# EAGLE schematic Arch GPRS (EAGLE 6.4)
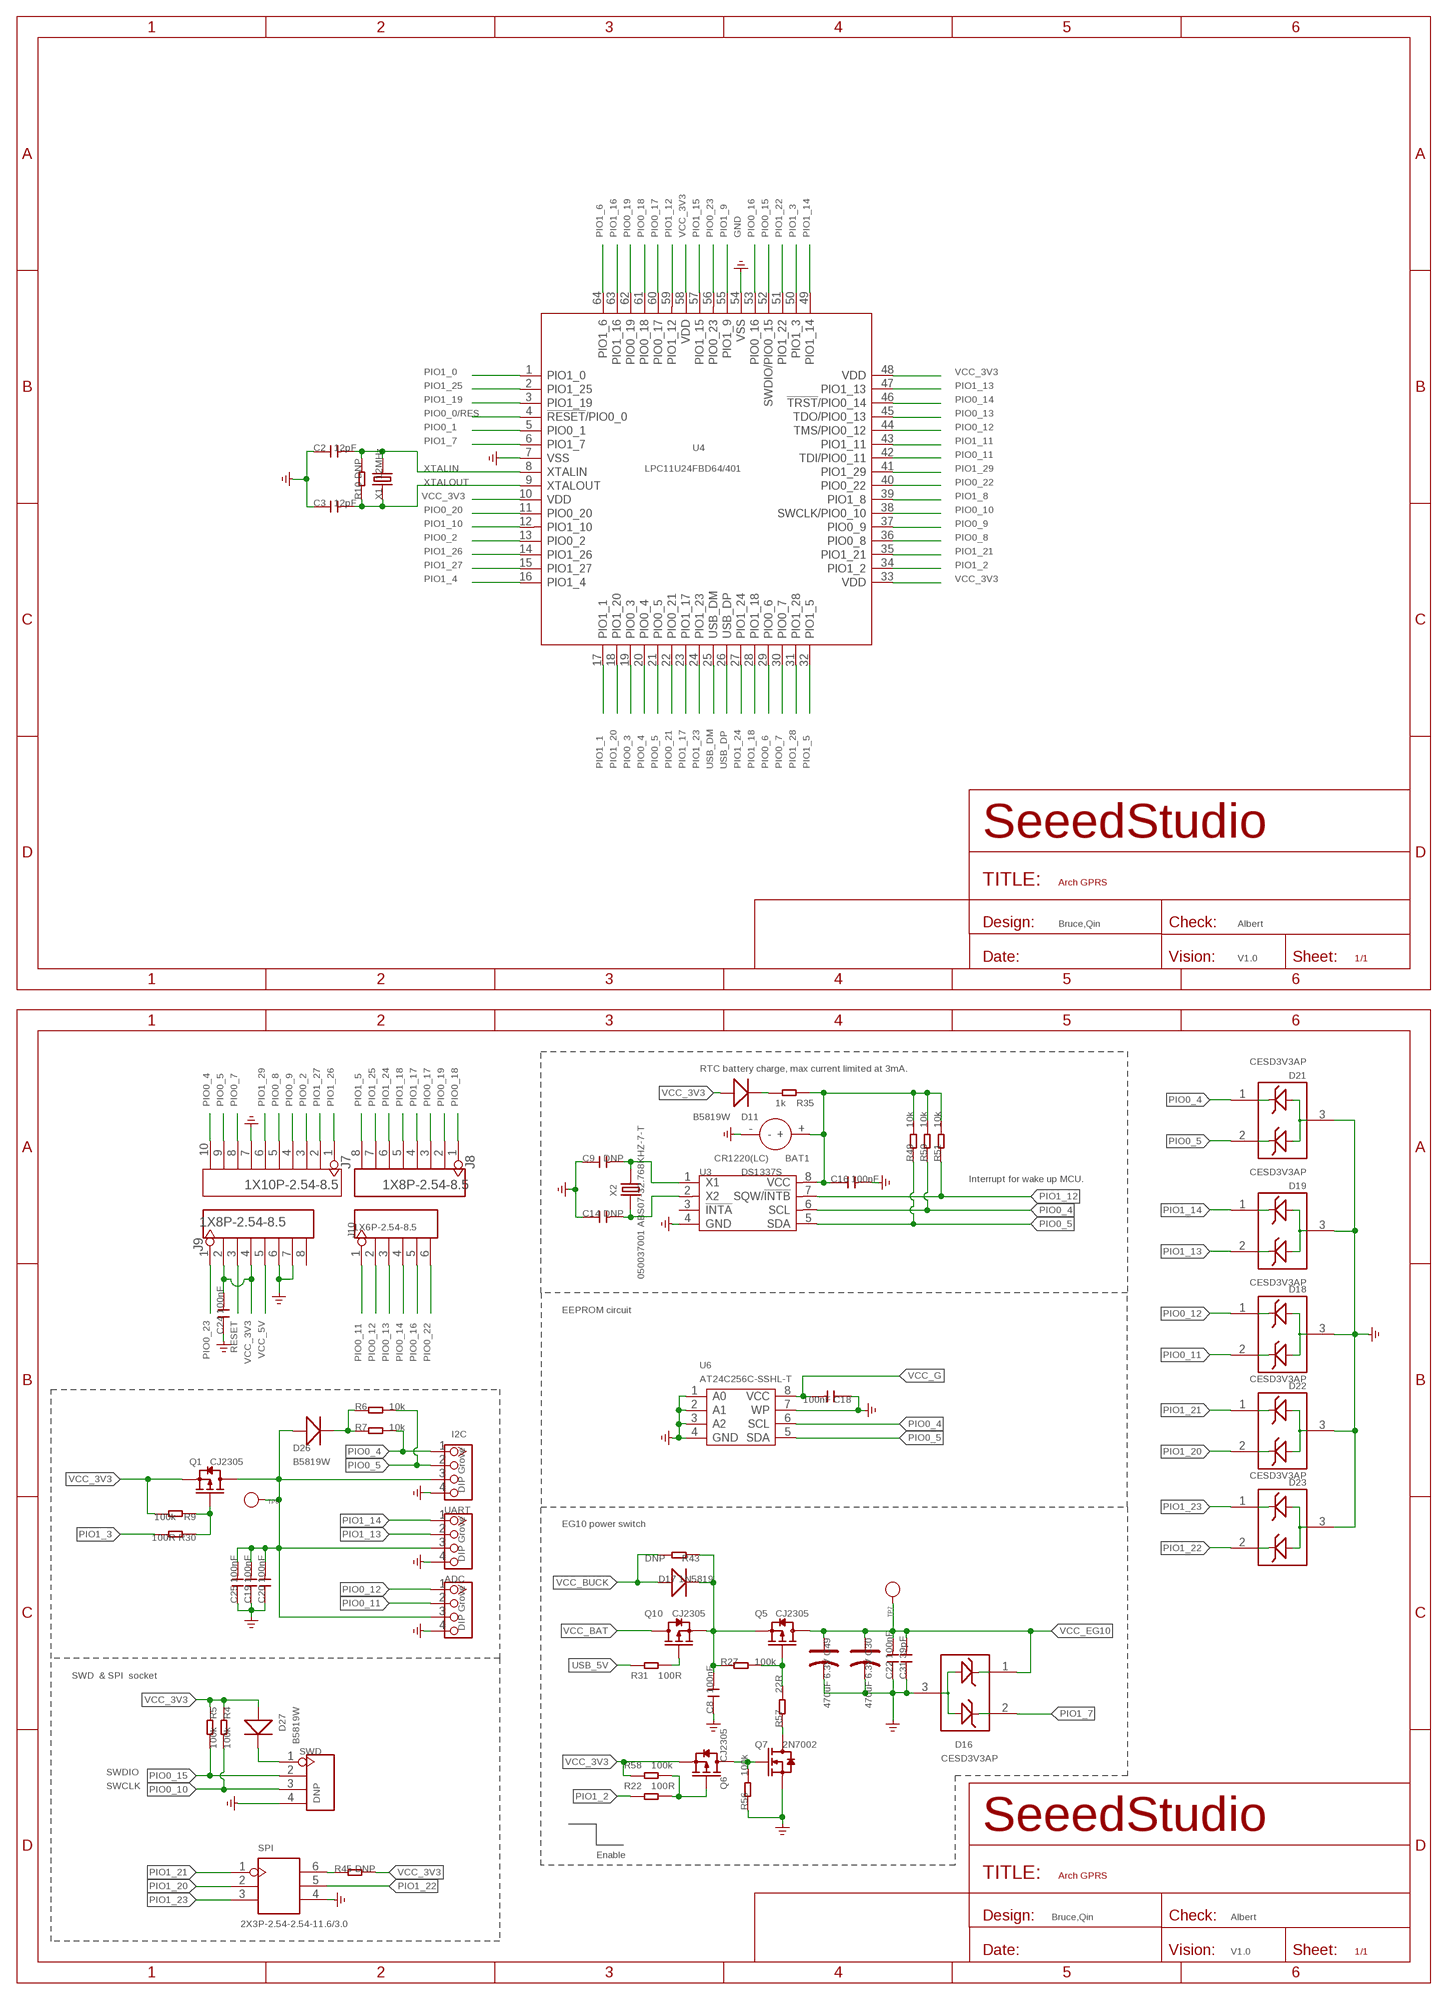
[diagram p0: schematic, sheet 1, part 1 of 2]
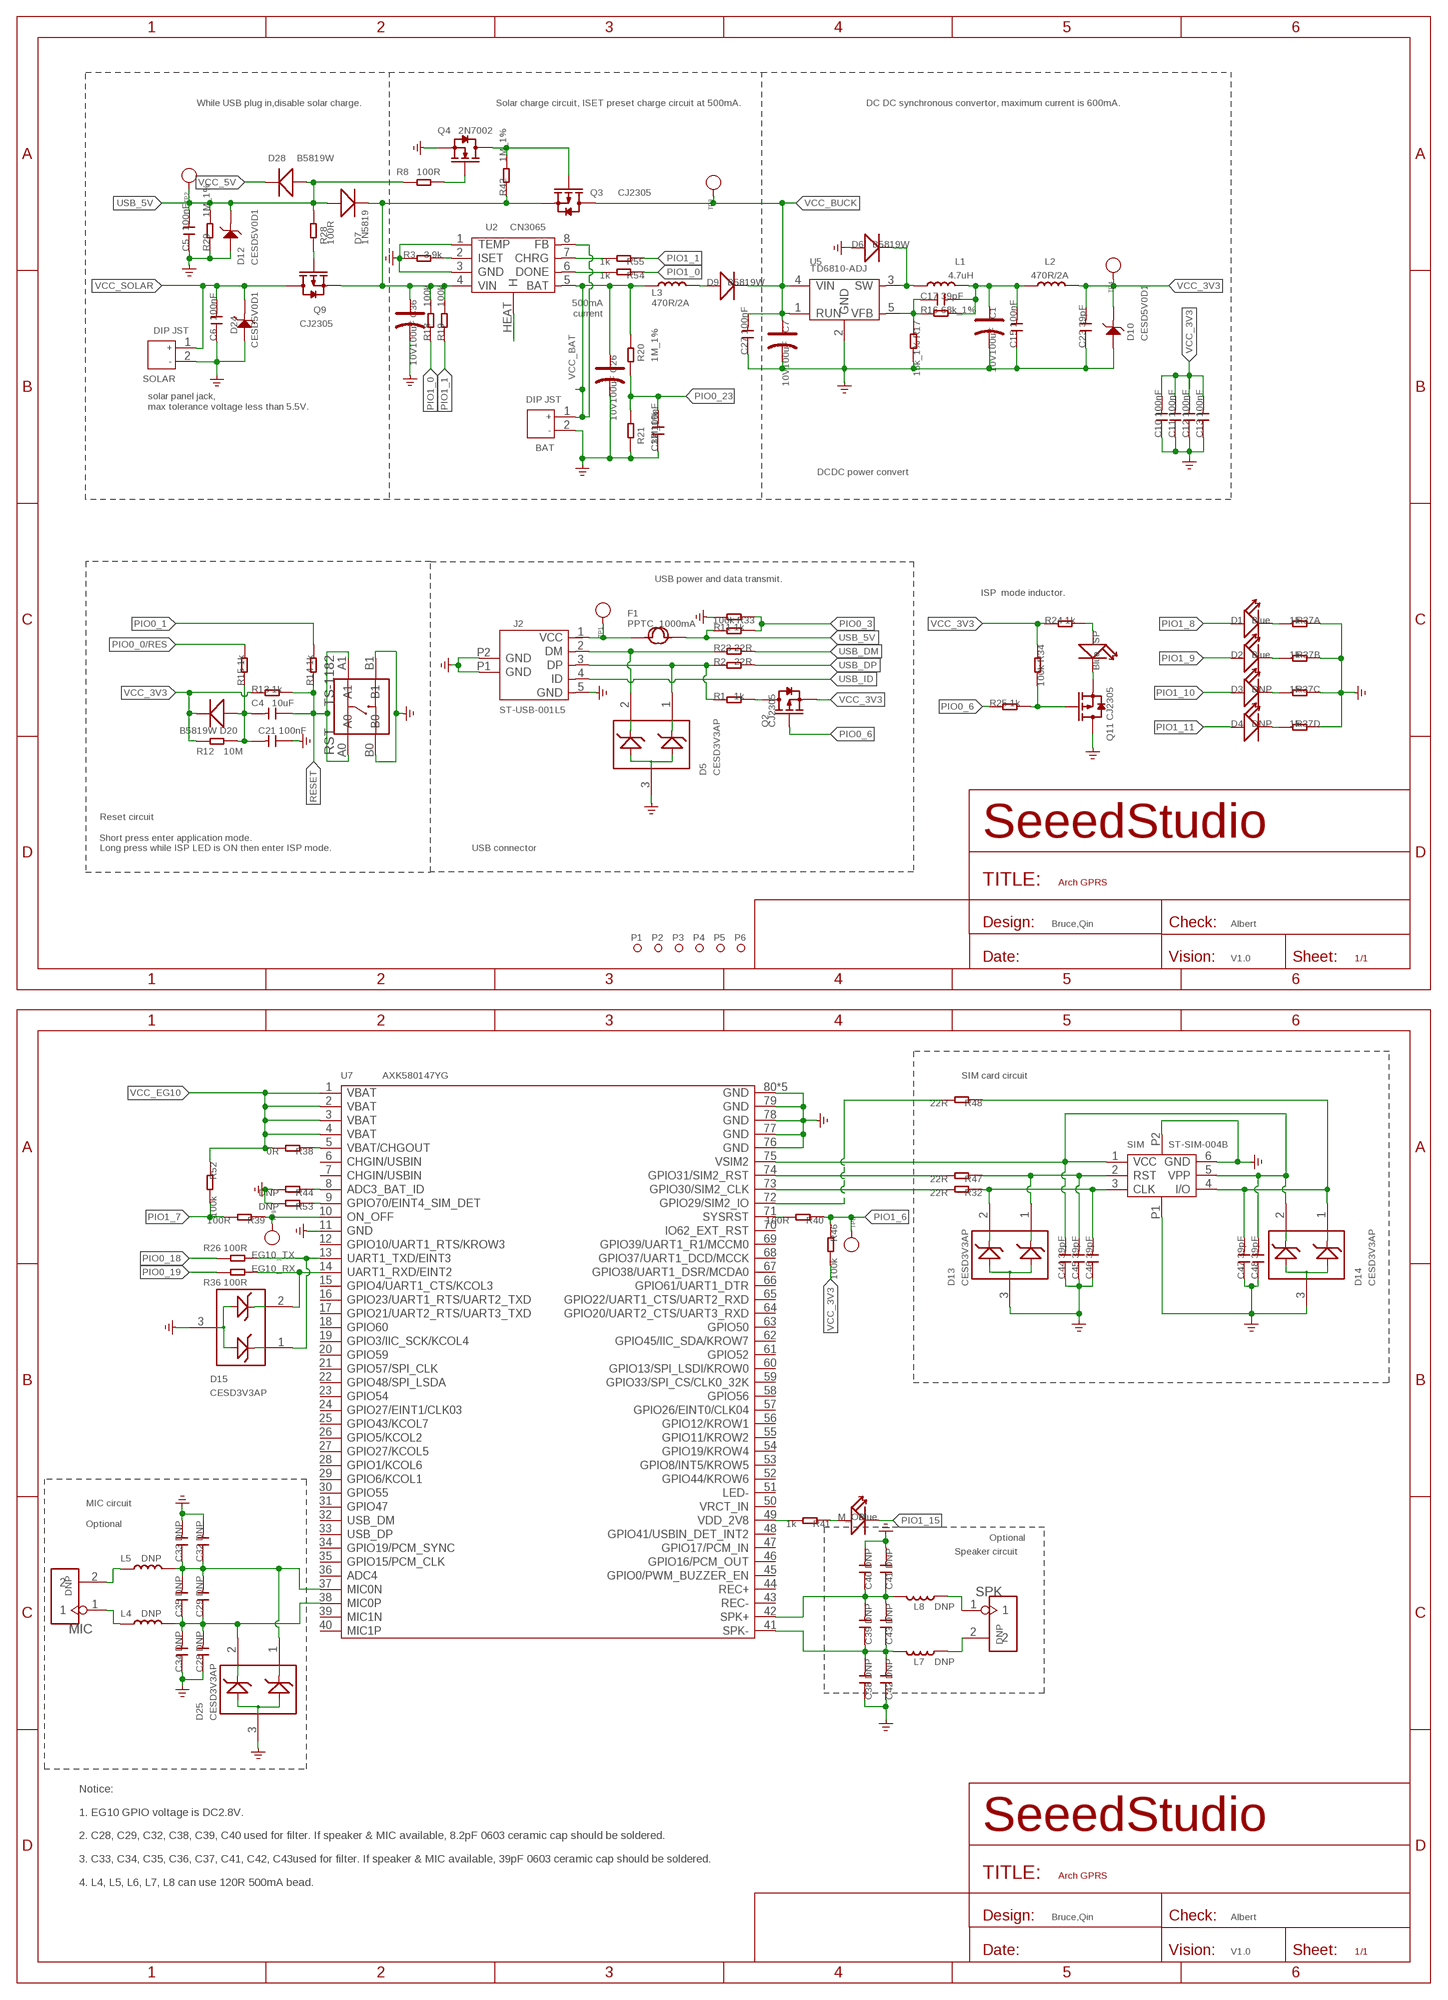
[diagram p1: schematic, sheet 1, part 2 of 2]

## Parts
ADC  DIP Grove  TWIG-4P-2.0-2.0  [4P-2.0]
BAT  DIP JST  JACK-JST-2P-PW'2.0'  [JST-2.0]
BAT1  CR1220(LC)  BATTERY-3V  [2P-D12.55X2.22H]
C1  10V100uF  CAP-AVX-B  [AVX-B]
C2  12pF  C-0603  [C0603]
C3  12pF  C-0603  [C0603]
C4  10uF  C-0805  [C0805]
C5  100nF  C-0603  [C0603]
C6  100nF  C-0603  [C0603]
C7  10V100uF  CAP-AVX-B  [AVX-B]
C8  100nF  C-0603  [C0603]
C9  DNP  C-0603  [C0603]
C10  100nF  C-0603  [C0603]
C11  100nF  C-0603  [C0603]
C12  100nF  C-0603  [C0603]
C13  100nF  C-0603  [C0603]
C14  DNP  C-0603  [C0603]
C15  100nF  C-0603  [C0603]
C16  100nF  C-0603  [C0603]
C17  39pF  C-0603  [C0603]
C18  100nF  C-0603  [C0603]
C19  100nF  C-0603  [C0603]
C20  100nF  C-0603  [C0603]
C21  100nF  C-0603  [C0603]
C22  100nF  C-0603  [C0603]
C23  39pF  C-0603  [C0603]
C24  100nF  C-0603  [C0603]
C25  100nF  C-0603  [C0603]
C26  10V100uF  CAP-AVX-B  [AVX-B]
C27  100nF  C-0603  [C0603]
C28  DNP  C-0603  [C0603]
C29  DNP  C-0603  [C0603]
C30  470uF 6.3V  CAP-AVX-D  [AVX-D]
C31  39pF  C-0603  [C0603]
C32  DNP  C-0603  [C0603]
C33  DNP  C-0603  [C0603]
C34  DNP  C-0603  [C0603]
C35  DNP  C-0603  [C0603]
C36  10V100uF  CAP-AVX-B  [AVX-B]
C37  100nF  C-0603  [C0603]
C38  DNP  C-0603  [C0603]
C39  DNP  C-0603  [C0603]
C40  DNP  C-0603  [C0603]
C41  DNP  C-0603  [C0603]
C42  DNP  C-0603  [C0603]
C43  DNP  C-0603  [C0603]
C44  39pF  C-0603  [C0603]
C45  39pF  C-0603  [C0603]
C46  39pF  C-0603  [C0603]
C47  39pF  C-0603  [C0603]
C48  39pF  C-0603  [C0603]
C49  470uF 6.3V  CAP-AVX-D  [AVX-D]
D1  Blue  LED'0603'  [LED-0603]
D2  Blue  LED'0603'  [LED-0603]
D3  DNP  LED'0603'  [LED-0603]
D4  DNP  LED'0603'  [LED-0603]
D5  CESD3V3AP  D-ESD-3P  [SOT23]
D6  B5819W  D'1206'  [SOD123]
D7  1N5819  D'B130L-13-F'  [SMA]
D9  B5819W  D'1206'  [SOD123]
D10  CESD5V0D1  D-ESD-2P'CESD5V0D1'  [SOD123-2.7X1.6]
D11  B5819W  D'1206'  [SOD123]
D12  CESD5V0D1  D-ESD-2P'CESD5V0D1'  [SOD123-2.7X1.6]
D13  CESD3V3AP  D-ESD-3P  [SOT23]
D14  CESD3V3AP  D-ESD-3P  [SOT23]
D15  CESD3V3AP  D-ESD-3P  [SOT23]
D16  CESD3V3AP  D-ESD-3P  [SOT23]
D17  1N5819  D'B130L-13-F'  [SMA]
D18  CESD3V3AP  D-ESD-3P  [SOT23]
D19  CESD3V3AP  D-ESD-3P  [SOT23]
D20  B5819W  D'1206'  [SOD123]
D21  CESD3V3AP  D-ESD-3P  [SOT23]
D22  CESD3V3AP  D-ESD-3P  [SOT23]
D23  CESD3V3AP  D-ESD-3P  [SOT23]
D24  CESD5V0D1  D-ESD-2P'CESD5V0D1'  [SOD123-2.7X1.6]
D25  CESD3V3AP  D-ESD-3P  [SOT23]
D26  B5819W  D'1206'  [SOD123]
D27  B5819W  D'1206'  [SOD123]
D28  B5819W  D'1206'  [SOD123]
F1  PPTC_1000mA  FUSE'1206'  [F1206]
I2C  DIP Grove  TWIG-4P-2.0-2.0  [4P-2.0]
ISP  Blue  LED'0603'  [LED-0603]
J2  ST-USB-001L5  USB-MICRO-5P'ST-USB-001L5'  [MICRO-5P-180D]
J7  1X10P-2.54-8.5  HEADER-10P-2.54  [10P-2.54]
J8  1X8P-2.54-8.5  HEADER-8P-2.54  [8P-2.54]
J9  1X8P-2.54-8.5  HEADER-8P-2.54  [8P-2.54]
J10  1X6P-2.54-8.5  HEADER-6P-65/35MIL  [6P-2.54-65/35MIL]
L1  4.7uH  LSPD3D16-4R7M  [L0420]
L2  470R/2A  L'0805'  [L0805]
L3  470R/2A  L'0805'  [L0805]
L4  DNP  L'0603'  [L0603]
L5  DNP  L'0603'  [L0603]
L7  DNP  L'0603'  [L0603]
L8  DNP  L'0603'  [L0603]
M_ON  Blue  LED'0603'  [LED-0603]
MIC  DNP  HEADER-2P-2.0  [2P-2.0]
P1  PAD-MARK  [ROUND-MARK-1.0]
P2  PAD-MARK  [ROUND-MARK-1.0]
P3  PAD-MARK  [ROUND-MARK-1.0]
P4  PAD-MARK  [ROUND-MARK-1.0]
P5  PAD-MARK  [ROUND-MARK-1.0]
P6  PAD-MARK  [ROUND-MARK-1.0]
Q1  CJ2305  MOSFET-P'SI2323CDS/SI2305DS<BR>'  [SOT23]
Q2  CJ2305  MOSFET-P'SI2323CDS/SI2305DS<BR>'  [SOT23]
Q3  CJ2305  MOSFET-P'SI2323CDS/SI2305DS<BR>'  [SOT23]
Q4  2N7002  MOSFET-N'SOT23'  [SOT23]
Q5  CJ2305  MOSFET-P'SI2323CDS/SI2305DS<BR>'  [SOT23]
Q6  CJ2305  MOSFET-P'SI2323CDS/SI2305DS<BR>'  [SOT23]
Q7  2N7002  MOSFET-N'SOT23'  [SOT23]
Q9  CJ2305  MOSFET-P'SI2323CDS/SI2305DS<BR>'  [SOT23]
Q10  CJ2305  MOSFET-P'SI2323CDS/SI2305DS<BR>'  [SOT23]
Q11  CJ2305  MOSFET-P'SI2323CDS/SI2305DS<BR>'  [SOT23]
R1  1k  R-0603  [R0603]
R2  22R  R-0603  [R0603]
R3  3.9k  R-0603  [R0603]
R4  100k  R-0603  [R0603]
R5  100k  R-0603  [R0603]
R6  10k  R-0603  [R0603]
R7  10k  R-0603  [R0603]
R8  100R  R-0603  [R0603]
R9  100k  R-0603  [R0603]
R10  DNP  R-0603  [R0603]
R11  1k  R-0603  [R0603]
R12  10M  R-0603  [R0603]
R13  1k  R-0603  [R0603]
R14  1k  R-0603  [R0603]
R15  1k  R-0603  [R0603]
R16  68k_1%  R-0603  [R0603]
R17  15k_1%  R-0603  [R0603]
R18  100k  R-0603  [R0603]
R19  100k  R-0603  [R0603]
R20  1M_1%  R-0603  [R0603]
R21  1M_1%  R-0603  [R0603]
R22  100R  R-0603  [R0603]
R23  22R  R-0603  [R0603]
R24  1k  R-0603  [R0603]
R25  1k  R-0603  [R0603]
R26  100R  R-0603  [R0603]
R27  100k  R-0603  [R0603]
R28  100R  R-0603  [R0603]
R29  1M_1%  R-0603  [R0603]
R30  100R  R-0603  [R0603]
R31  100R  R-0603  [R0603]
R32  22R  R-0603  [R0603]
R33  100k  R-0603  [R0603]
R34  100k  R-0603  [R0603]
R35  1k  R-0603  [R0603]
R36  100R  R-0603  [R0603]
R37  1k  R-4R-1206  [1206-8-3.3X2.4]
R38  0R  R-0603  [R0603]
R39  100R  R-0603  [R0603]
R40  100R  R-0603  [R0603]
R41  1k  R-0603  [R0603]
R42  1M_1%  R-0603  [R0603]
R43  DNP  R-0603  [R0603]
R44  DNP  R-0603  [R0603]
R45  DNP  R-0603  [R0603]
R46  100k  R-0603  [R0603]
R47  22R  R-0603  [R0603]
R48  22R  R-0603  [R0603]
R49  10k  R-0603  [R0603]
R50  10k  R-0603  [R0603]
R51  10k  R-0603  [R0603]
R52  100k  R-0603  [R0603]
R53  DNP  R-0603  [R0603]
R54  1k  R-0603  [R0603]
R55  1k  R-0603  [R0603]
R56  100k  R-0603  [R0603]
R57  22R  R-0603  [R0603]
R58  100k  R-0603  [R0603]
RST  TS-1182  BUTTON-4P-3.3X3.3  [4P-SMD-3.4X3.4X1.3H]
SIM  ST-SIM-004B  SIM-CARD'ST-SIM-004B'  [6P-1.8]
SOLAR  DIP JST  JACK-JST-2P-PW'2.0'  [JST-2.0]
SPI  2X3P-2.54-2.54-11.6/3.0  HEADER-2X3P-2.54  [2X3P-2.54]
SPK  DNP  HEADER-2P-2.0  [2P-2.0]
SWD  DNP  HEADER-4P-65/35MIL  [4P-65/35MIL]
TP1  PAD-TEST-POINT'4545'  [TP_4545]
TP2  PAD-TEST-POINT'4545'  [TP_4545]
TP3  PAD-TEST-POINT'4545'  [TP_4545]
TP4  PAD-TEST-POINT'4545'  [TP_4545]
TP6  PAD-TEST-POINT'4545'  [TP_4545]
TP7  PAD-TEST-POINT'4545'  [TP_4545]
TP8  PAD-TEST-POINT'4545'  [TP_4545]
TP9  PAD-TEST-POINT'4545'  [TP_4545]
U2  CN3065  CN3065-DFN8  [DFN8]
U3  DS1337S  [SOP8]
U4  LPC11U24FBD64/401  LPC11U2X'LPC11U24FBD64/401'  [LQFP64]
U5  TD6810-ADJ  TD6810'TSOT23-5'  [SOT23-5]
U6  AT24C256C-SSHL-T  AT24C256C'  [SOIC8-6.0]
U7  AXK580147YG  GPRS-MOUDLE-SOCKET'AXK580147YG'  [80P-0.5-3H]
UART  DIP Grove  TWIG-4P-2.0-2.0  [4P-2.0]
X1  12MHz  CRYSTAL'5032'  [2P-SMD-5X3.2]
X2  050037001 ABS07-32.768KHZ-7-T  CRYSTAL-3215  [2P-SMD-3.2X1.5]

## Nets
EG10_2V8: R41.2 U7.49(VDD_2V8)
EG10_MIC0+: C28.2 C29.1 C34.2 C35.1 D25.2 L4.2 U7.38(MIC0P)
EG10_MIC0+1: C39.2 C40.1 C41.1 C43.2 L8.1 U7.42(SPK+)
EG10_MIC0-: C29.2 C32.1 C33.1 C35.2 D25.1 L5.2 U7.37(MIC0N)
EG10_RST: R40.2 U7.71(SYSRST)
EG10_RX: D15.2 R36.1 U7.14(UART1_RXD/EINT2)
EG10_SIM_CLK: C46.2 D13.2 R32.1 SIM.3(CLK)
EG10_SIM_IO: C47.2 D14.1 R48.1 SIM.4(I/O)
EG10_SIM_RST: C45.2 D13.1 R47.1 SIM.2(RST)
EG10_SIM_VCC: C44.2 C48.2 D14.2 SIM.1(VCC) SIM.5(VPP) U7.75(VSIM2)
EG10_SPK-: C38.2 C39.1 C42.2 C43.1 L7.1 U7.41(SPK-)
EG10_TX: D15.1 R26.1 U7.13(UART1_TXD/EINT3)
GND: ADC.4 BAT1.- BAT.2 C1.- C2.1 C3.1 C5.1 C6.1 C7.- C8.1 C9.1 C10.1 C11.1 C12.1 C13.1 C14.1 C15.1 C16.2 C18.1 C19.1 C20.1 C21.1 C22.1 C23.1 C24.1 C25.1 C26.- C27.1 C28.1 C30.- C31.1 C32.2 C33.2 C34.1 C36.- C37.1 C38.1 C40.2 C41.2 C42.1 C44.1 C45.1 C46.1 C47.1 C48.1 C49.- D5.3 D6.+ D10.1 D12.1 D13.3 D14.3 D15.3 D16.3 D18.3 D19.3 D21.3 D22.3 D23.3 D24.1 D25.3 I2C.4 J2.5(GND) J2.P1(GND) J2.P2(GND) J7.7 J9.6 J9.7 Q4.2(S) Q7.2(S) Q11.3(D) R3.1 R17.2 R21.1 R29.1 R33.2 R37.1 R37.2 R37.3 R37.4 R44.2 R53.2 R56.1 RST.B0 RST.B1 SIM.6(GND) SIM.P1 SIM.P2 SOLAR.2 SPI.4 SWD.4 U2.1(TEMP) U2.3(GND) U3.4(GND) U4.7(VSS) U4.54(VSS) U5.2(GND) U6.1(A0) U6.2(A1) U6.3(A2) U6.4(GND) U6.7(WP) U7.11(GND) U7.76(GND) U7.77(GND) U7.78(GND) U7.79(GND) U7.80(GND) U7.P1(GND) U7.P2(GND) U7.P3(GND) U7.P4(GND) UART.4
HEAT: U2.HEAT(H)
N$1: D27.- SWD.1
N$2: D4.- R37.5
N$3: Q2.3(D) R1.2
N$4: Q5.1(G) R27.2 R57.2
N$5: R3.2 U2.2(ISET)
N$6: D11.- R35.1
N$7: C4.2 C21.2 D20.+ R12.2 R15.1
N$8: Q3.1(G) Q4.3(D) R42.2
N$9: C8.2 D17.1(-) Q5.2(S) Q10.2(S) R27.1 R43.1
N$10: D9.+ L3.2
N$11: R48.2 U7.72(GPIO29/SIM2_IO)
N$12: Q1.1(G) R9.1 R30.1
N$13: C14.2 U3.2(X2) X2.1
N$14: C9.2 U3.1(X1) X2.2
N$15: Q11.1(G) R25.2 R34.2
N$16: ISP.- Q11.2(S)
N$17: D3.- R37.6
N$18: ISP.+ R24.2
N$19: D2.- R37.7
N$20: R47.2 U7.74(GPIO31/SIM2_RST)
N$21: R38.1 U7.5(VBAT/CHGOUT)
N$22: M_ON.+ R41.1
N$23: R45.1 SPI.6
N$24: BAT1.+ C16.1 R35.2 R49.2 R50.2 R51.2 U3.8(VCC)
N$25: R32.2 U7.73(GPIO30/SIM2_CLK)
N$26: R39.1 TP9.T U7.10(ON_OFF)
N$27: Q10.1(G) R31.1
N$28: L5.1 MIC.2
N$29: D6.- L1.1 U5.3(SW)
N$30: D1.- R37.8
N$31: L4.1 MIC.1
N$32: L7.2 SPK.2
N$33: Q9.1(G) R28.1
N$34: L8.2 SPK.1
N$35: D5.2 J2.2(DM) R23.1
N$36: D5.1 J2.3(DP) R1.1 R2.1
N$37: C36.+ D7.1(-) Q3.2(S) Q9.2(S) R18.2 R19.2 R42.1 U2.4(VIN)
N$38: F1.1 J2.1(VCC) TP1.T
N$39: C17.1 R16.1 R17.1 U5.5(VFB)
N$40: Q4.1(G) R8.1
N$41: R44.1 U7.8(ADC3_BAT_ID)
N$42: R53.1 U7.9(GPIO70/EINT4_SIM_DET)
N$43: R55.2 U2.7(CHRG)
N$44: R54.2 U2.6(DONE)
N$45: Q7.3(D) R57.1
N$46: Q6.3(D) Q7.1(G) R56.2
N$47: C1.+ C15.2 C17.2 L1.2 L2.1 R16.2
N$48: Q6.1(G) R22.1 R58.1
PIO0_0/RES: R15.2 U4.4(!RESET!/PIO0_0)
PIO0_1: R14.2 U4.5(PIO0_1)
PIO0_2: J7.3 U4.13(PIO0_2)
PIO0_3: R11.2 R33.1 U4.19(PIO0_3)
PIO0_4: D21.1 I2C.1 J7.10 R7.2 R50.1 U3.6(SCL) U4.20(PIO0_4) U6.6(SCL)
PIO0_5: D21.2 I2C.2 J7.9 R6.2 R49.1 U3.5(SDA) U4.21(PIO0_5) U6.5(SDA)
PIO0_6: Q2.1(G) R25.1 U4.29(PIO0_6)
PIO0_7: J7.8 U4.30(PIO0_7)
PIO0_8: J7.5 U4.36(PIO0_8)
PIO0_9: J7.4 U4.37(PIO0_9)
PIO0_10: R4.2 SWD.3 U4.38(SWCLK/PIO0_10)
PIO0_11: ADC.2 D18.2 J10.1 U4.42(TDI/PIO0_11)
PIO0_12: ADC.1 D18.1 J10.2 U4.44(TMS/PIO0_12)
PIO0_13: J10.3 U4.45(TDO/PIO0_13)
PIO0_14: J10.4 U4.46(!TRST!/PIO0_14)
PIO0_15: R5.2 SWD.2 U4.52(SWDIO/PIO0_15)
PIO0_16: J10.5 U4.53(PIO0_16)
PIO0_17: J8.3 U4.60(PIO0_17)
PIO0_18: J8.1 R26.2 U4.61(PIO0_18)
PIO0_19: J8.2 R36.2 U4.62(PIO0_19)
PIO0_20: U4.11(PIO0_20)
PIO0_21: U4.22(PIO0_21)
PIO0_22: J10.6 U4.40(PIO0_22)
PIO0_23: C37.2 J9.1 R20.1 R21.2 U4.56(PIO0_23)
PIO1_0: R18.1 R54.1 U4.1(PIO1_0)
PIO1_1: R19.1 R55.1 U4.17(PIO1_1)
PIO1_2: R22.2 U4.34(PIO1_2)
PIO1_3: R30.2 U4.50(PIO1_3)
PIO1_4: U4.16(PIO1_4)
PIO1_5: J8.8 U4.32(PIO1_5)
PIO1_6: R40.1 R46.1 TP8.T U4.64(PIO1_6)
PIO1_7: D16.2 R39.2 R52.2 U4.6(PIO1_7)
PIO1_8: D1.+ U4.39(PIO1_8)
PIO1_9: D2.+ U4.55(PIO1_9)
PIO1_10: D3.+ U4.12(PIO1_10)
PIO1_11: D4.+ U4.43(PIO1_11)
PIO1_12: R51.1 U3.7(SQW/!INTB) U4.59(PIO1_12)
PIO1_13: D19.2 U4.47(PIO1_13) UART.2
PIO1_14: D19.1 U4.49(PIO1_14) UART.1
PIO1_15: M_ON.- U4.57(PIO1_15)
PIO1_16: U4.63(PIO1_16)
PIO1_17: J8.4 U4.23(PIO1_17)
PIO1_18: J8.5 U4.28(PIO1_18)
PIO1_19: U4.3(PIO1_19)
PIO1_20: D22.2 SPI.2 U4.18(PIO1_20)
PIO1_21: D22.1 SPI.1 U4.35(PIO1_21)
PIO1_22: D23.2 SPI.5 U4.51(PIO1_22)
PIO1_23: D23.1 SPI.3 U4.24(PIO1_23)
PIO1_24: J8.6 U4.27(PIO1_24)
PIO1_25: J8.7 U4.2(PIO1_25)
PIO1_26: J7.1 U4.14(PIO1_26)
PIO1_27: J7.2 U4.15(PIO1_27)
PIO1_28: U4.31(PIO1_28)
PIO1_29: J7.6 U4.41(PIO1_29)
RESET: C4.1 J9.3 R13.2 R14.1 RST.A0 RST.A1
USB_5V: C5.2 D7.2(+) D12.2 D28.+ F1.2 R8.2 R11.1 R28.2 R29.2 R31.2 TP2.T
USB_DM: R23.2 U4.25(USB_DM)
USB_DP: R2.2 U4.26(USB_DP)
USB_ID: J2.4(ID)
VCC_3V3: C10.2 C11.2 C12.2 C13.2 C23.2 C24.2 D10.2 D11.+ D20.- D27.+ J9.2 J9.4 L2.2 Q1.2(S) Q2.2(S) Q6.2(S) R4.1 R5.1 R9.2 R12.1 R13.1 R24.1 R34.1 R45.2 R46.2 R58.2 TP4.T U4.10(VDD) U4.33(VDD) U4.48(VDD) U4.58(VDD)
VCC_5V: D28.- J9.5
VCC_BAT: BAT.1 C26.+ L3.1 Q10.3(D) R20.2 U2.5(BAT) U2.8(FB)
VCC_BUCK: C7.+ C27.2 D9.- D17.2(+) Q3.3(D) R43.2 TP3.T U5.1(RUN) U5.4(VIN)
VCC_EG10: C22.2 C30.+ C31.2 C49.+ D16.1 Q5.3(D) R38.2 R52.1 TP7.T U7.1(VBAT) U7.2(VBAT) U7.3(VBAT) U7.4(VBAT)
VCC_G: ADC.3 C18.2 C19.2 C20.2 C25.2 D26.+ I2C.3 Q1.3(D) TP6.T U6.8(VCC) UART.3
VCC_I2C: D26.- R6.1 R7.1
VCC_SOLAR: C6.2 D24.2 Q9.3(D) SOLAR.1
XTALIN: C2.2 R10.2 U4.8(XTALIN) X1.2
XTALOUT: C3.2 R10.1 U4.9(XTALOUT) X1.1
Unconnected: J9.8 U3.3(!INTA) U7.6(CHGIN/USBIN) U7.7(CHGIN/USBIN) U7.12(GPIO10/UART1_RTS/KROW3) U7.15(GPIO4/UART1_CTS/KCOL3) U7.16(GPIO23/UART1_RTS/UART2_TXD) U7.17(GPIO21/UART2_RTS/UART3_TXD) U7.18(GPIO60) U7.19(GPIO3/IIC_SCK/KCOL4) U7.20(GPIO59) U7.21(GPIO57/SPI_CLK) U7.22(GPIO48/SPI_LSDA) U7.23(GPIO54) U7.24(GPIO27/EINT1/CLK03) U7.25(GPIO43/KCOL7) U7.26(GPIO5/KCOL2) U7.27(GPIO27/KCOL5) U7.28(GPIO1/KCOL6) U7.29(GPIO6/KCOL1) U7.30(GPIO55) U7.31(GPIO47) U7.32(USB_DM) U7.33(USB_DP) U7.34(GPIO19/PCM_SYNC) U7.35(GPIO15/PCM_CLK) U7.36(ADC4) U7.39(MIC1N) U7.40(MIC1P) U7.43(REC-) U7.44(REC+) U7.45(GPIO0/PWM_BUZZER_EN) U7.46(GPIO16/PCM_OUT) U7.47(GPIO17/PCM_IN) U7.48(GPIO41/USBIN_DET_INT2) U7.50(VRCT_IN) U7.51(LED-) U7.52(GPIO44/KROW6) U7.53(GPIO8/INT5/KROW5) U7.54(GPIO19/KROW4) U7.55(GPIO11/KROW2) U7.56(GPIO12/KROW1) U7.57(GPIO26/EINT0/CLK04) U7.58(GPIO56) U7.59(GPIO33/SPI_CS/CLK0_32K) U7.60(GPIO13/SPI_LSDI/KROW0) U7.61(GPIO52) U7.62(GPIO45/IIC_SDA/KROW7) U7.63(GPIO50) U7.64(GPIO20/UART2_CTS/UART3_RXD) U7.65(GPIO22/UART1_CTS/UART2_RXD) U7.66(GPIO61/UART1_DTR) U7.67(GPIO38/UART1_DSR/MCDA0) U7.68(GPIO37/UART1_DCD/MCCK) U7.69(GPIO39/UART1_R1/MCCM0) U7.70(IO62_EXT_RST)

## Notes on the sheet
- While USB plug in,disable solar charge. | Solar charge circuit, ISET preset charge circuit at 500mA. | DC DC synchronous convertor, maximum current is 600mA.
- 500mA
  current
- solar panel jack, 
  max tolerance voltage less than 5.5V.
- DCDC power convert
- USB power and data transmit.
- ISP  mode inductor.
- Reset circuit
  
  Short press enter application mode.
  Long press while ISP LED is ON then enter ISP mode.
- USB connector
- Bruce,Qin | Albert | Bruce,Qin | Albert
- V1.0 | V1.0
- RTC battery charge, max current limited at 3mA.
- SIM card circuit
- Interrupt for wake up MCU.
- EEPROM circuit
- MIC circuit
- EG10 power switch | Optional
- Optional
- Speaker circuit
- SWD  & SPI  socket
- SWDIO
- SWCLK
- Enable
- Notice:
  
  1. EG10 GPIO voltage is DC2.8V.
  
  2. C28, C29, C32, C38, C39, C40 used for filter. If speaker & MIC available, 8.2pF 0603 ceramic cap should be soldered.
  
  3. C33, C34, C35, C36, C37, C41, C42, C43used for filter. If speaker & MIC available, 39pF 0603 ceramic cap should be soldered.
  
  4. L4, L5, L6, L7, L8 can use 120R 500mA bead.
- Bruce,Qin | Albert | Bruce,Qin | Albert
- V1.0 | V1.0

## Library data of the parts
ADC I2C UART = Connector:TWIG-4P-2.0
BAT SOLAR = Connector :JACK-JST-2P-PW
BAT1 = template:BATTERY-3V
C1 C7 C26 C30 C36 C49 = Discrete:CAP*: Electrolytic Capacitors,Tantalum Capacitors and Super Capacitors
C2-C6 C8-C17 C19-C25 C27-C29 C31-C35 C37-C48 = Discrete:C*: Ceramic Capacitors
C18 = Discrete (1):C*: Ceramic Capacitors
D1-D4 ISP M_ON = Discrete:LED*
D5 D13-D16 D18 D19 D21-D23 D25 = Discrete:D-ESD-3P
D6 D7 D9 D11 D17 D20 D26-D28 = Discrete:D*
D10 D12 D24 = Discrete:D-ESD-2P: Diodes for Protectiong against ESD
F1 = Discrete:FUSE
J2 = template:USB-MICRO-5P: ST-USB-001L5 The Size of ST-USB-001L5 is 8.0X2.35X5.61mm.when you use it ,you need know that the Size of pin is only 1.6MM.
J7 = Connector :HEADER-10P
J8 J9 = Connector :HEADER-8P
J10 = Connector :HEADER-6P
L1 = template:L
L2-L5 L7 L8 = Discrete:L*
MIC SPK = Connector :HEADER-2P
P1-P6 = Discrete:PAD-MARK; PARTNO: DNP
Q1-Q3 Q5 Q6 Q9-Q11 = Discrete:MOSFET-P
Q4 Q7 = Discrete:MOSFET-N: IRLL014: http://www.vishay.com/docs/91319/sihll014.pdf
R1-R36 R38-R58 = Discrete:R*
R37 = Discrete:R-4R*: Resistor Array
RST = Discrete:BUTTON-4P
SIM = template:SIM-CARD
SPI = Connector :HEADER-2X3P
SWD = Connector :HEADER-4P
TP1-TP4 TP6-TP9 = Discrete:PAD-TEST-POINT; PARTNO: DNP
U2 = IC:CN3065: USB-Compatible Lithiumt-Ion Battery Charger with Thermal Regulation http://www.consonance-elec.com/pdf/%E6%8A%80%E6%9C%AF%E8%AF%B4%E6%98%8E%E4%B9%A6/DSC-CN3065.pdf
U3 = For_Test_Albert:DS1337: I2C Serial Real-Time clock http://datasheets.maximintegrated.com/en/ds/DS1337-DS1337C.pdf
U4 = template:LPC11U2X: 32-Bit ARM Cortex-M0 Microcontroller
U5 = template:TD6810: 1.5MHz 800mA Synchronous Step-Down Regulator Dropout http://www.techcodeok.com/download/TD6810.pdf
U6 = template:AT24C256C: Two-wire Serial EEPROM 256K (32,768 x 8)
U7 = template:GPRS-MOUDLE-SOCKET
X1 X2 = Discrete:CRYSTAL*: CRYSTAL

## Net classes
0 default: clearance 0.152 mm